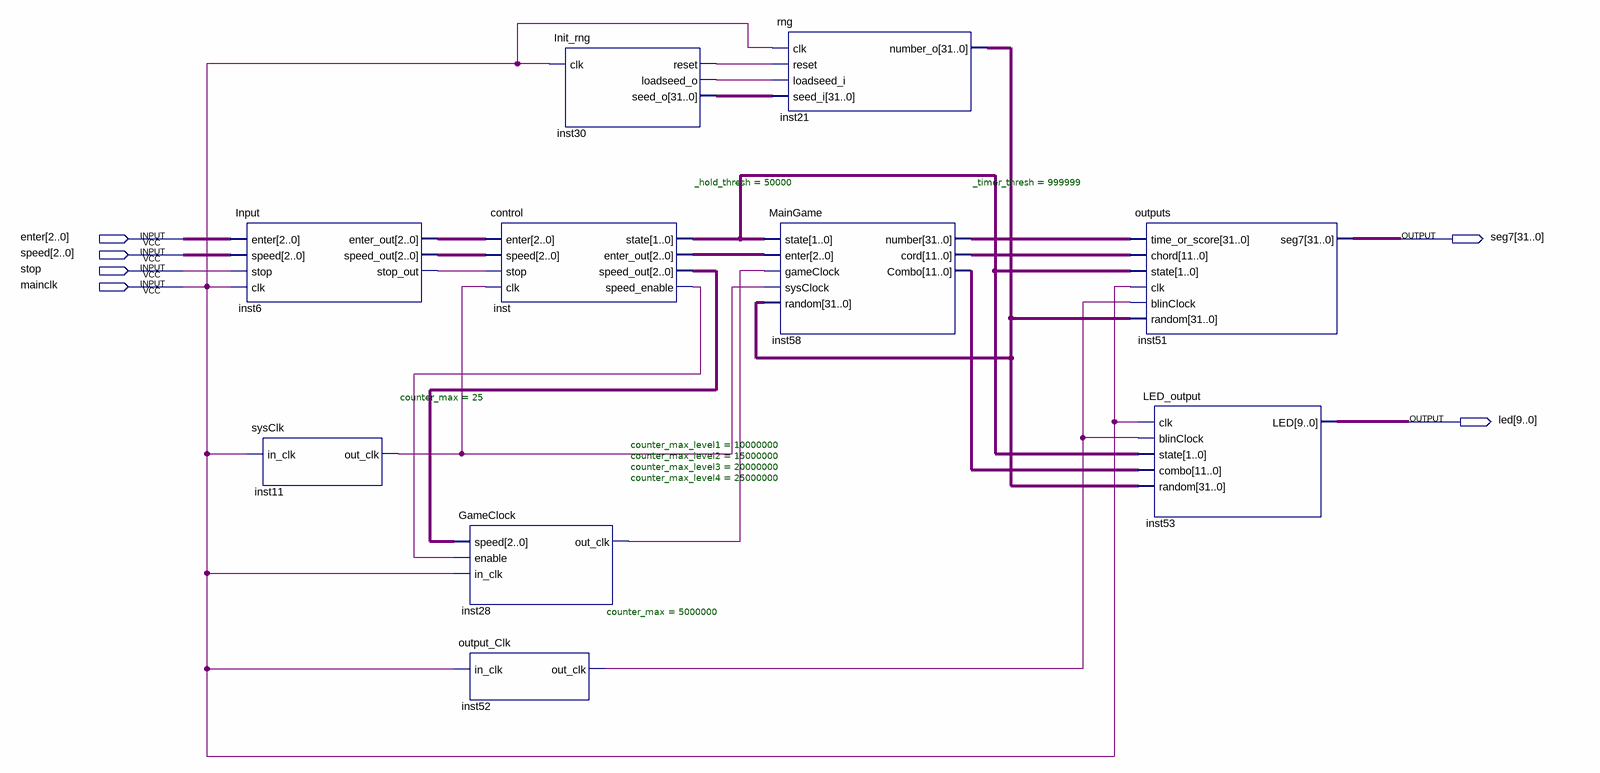
[diagram p0: schematic sheet]
// Quartus schematic Lab1.bdf as structural Verilog: 10 symbols, 6 pins
module Lab1 (
  input  [2:0] enter,
  input  [2:0] speed,
  input  stop,
  input  mainclk,
  output [31:0] seg7,
  output [9:0] led
);

  wire inst6_stop_out, inst11_out_clk, inst28_out_clk, inst30_loadseed_o, inst30_reset, inst52_out_clk,
       inst_speed_enable;
  wire [1:0] inst_state;
  wire [2:0] inst6_enter_out, inst6_speed_out, inst_enter_out, inst_speed_out;
  wire [11:0] inst58_combo, inst58_cord;
  wire [31:0] inst21_number_o, inst30_seed_o, inst58_number;

  Input inst6 (
    .enter(enter), .speed(speed), .stop(stop), .clk(mainclk), .enter_out(inst6_enter_out),
    .speed_out(inst6_speed_out), .stop_out(inst6_stop_out));
  sysClk #(.counter_max(25)) inst11 (.in_clk(mainclk), .out_clk(inst11_out_clk));
  control #(._hold_thresh(50000)) inst (
    .enter(inst6_enter_out), .speed(inst6_speed_out), .stop(inst6_stop_out), .clk(inst11_out_clk),
    .state(inst_state), .enter_out(inst_enter_out), .speed_out(inst_speed_out),
    .speed_enable(inst_speed_enable));
  GameClock #(.counter_max_level1(10000000), .counter_max_level2(15000000), .counter_max_level3(20000000), .counter_max_level4(25000000)) inst28 (
    .speed(inst_speed_out), .enable(inst_speed_enable), .in_clk(mainclk), .out_clk(inst28_out_clk));
  output_Clk #(.counter_max(5000000)) inst52 (.in_clk(mainclk), .out_clk(inst52_out_clk));
  Init_rng inst30 (.clk(mainclk), .reset(inst30_reset), .loadseed_o(inst30_loadseed_o), .seed_o(inst30_seed_o));
  MainGame #(._timer_thresh(999999)) inst58 (
    .state(inst_state), .enter(inst_enter_out), .gameClock(inst28_out_clk), .sysClock(inst11_out_clk),
    .random(inst21_number_o), .number(inst58_number), .cord(inst58_cord), .Combo(inst58_combo));
  rng inst21 (
    .clk(mainclk), .reset(inst30_reset), .loadseed_i(inst30_loadseed_o), .seed_i(inst30_seed_o),
    .number_o(inst21_number_o));
  outputs inst51 (
    .time_or_score(inst58_number), .chord(inst58_cord), .state(inst_state), .clk(mainclk),
    .blinClock(inst52_out_clk), .random(inst21_number_o), .seg7(seg7));
  LED_output inst53 (
    .clk(mainclk), .blinClock(inst52_out_clk), .state(inst_state), .combo(inst58_combo),
    .random(inst21_number_o), .LED(led));
endmodule
